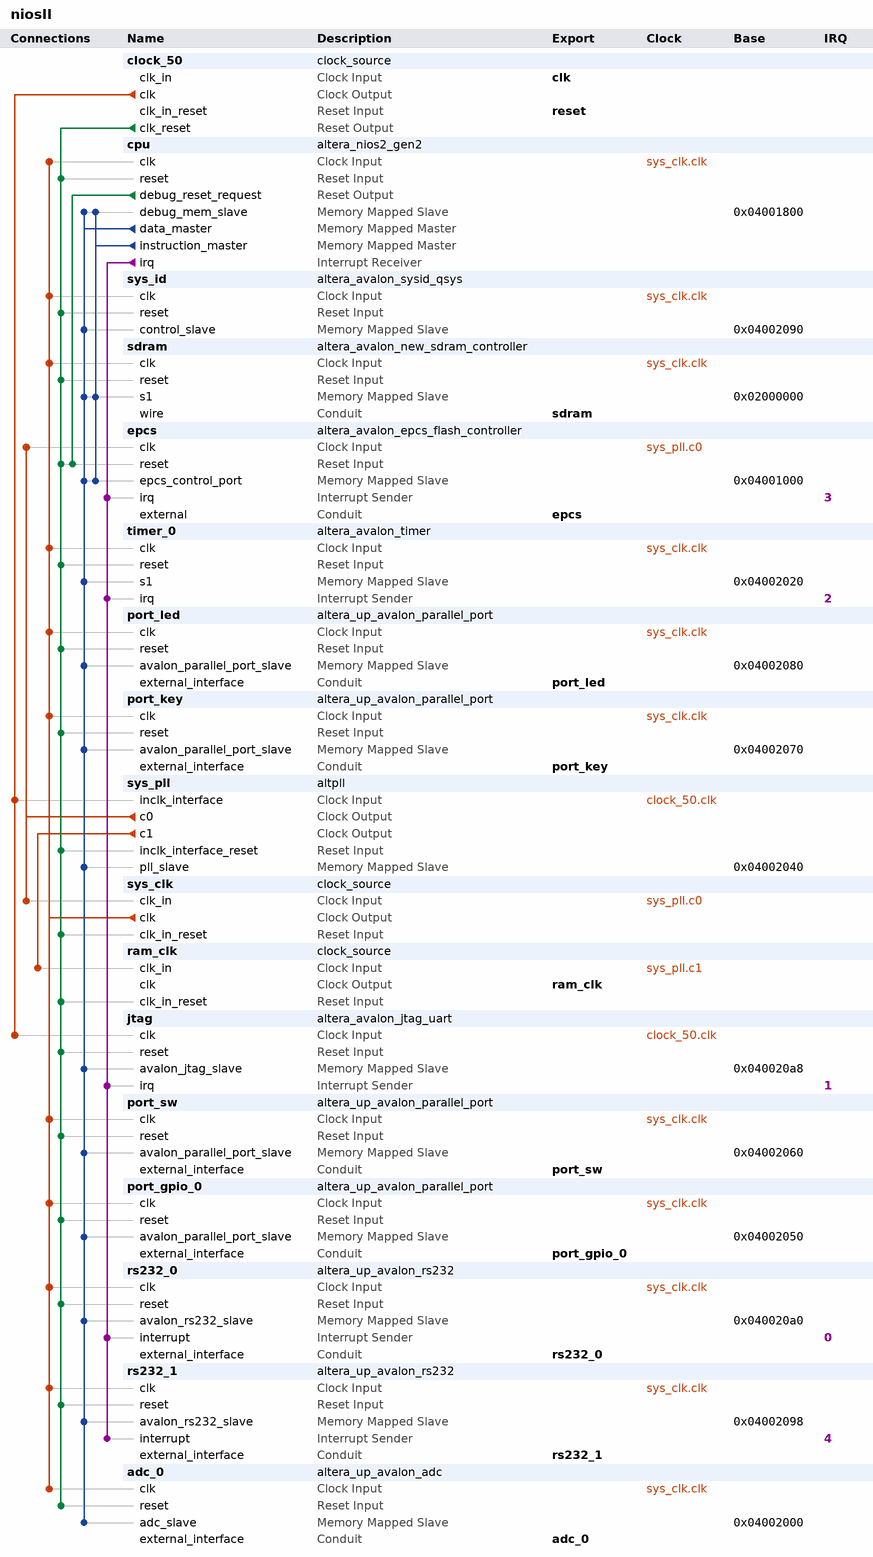
[diagram p0: system contents]
# Platform Designer (Qsys) system niosII, Cyclone IV E EP4CE22F17C6
# Parameters at their usual value, and those the tool derives, are not listed.
package require -exact qsys 17.1
create_system niosII
set_project_property DEVICE_FAMILY {Cyclone IV E}
set_project_property DEVICE EP4CE22F17C6

add_instance clock_50 clock_source 17.1
set_instance_parameter_value clock_50 clockFrequency 50000000

add_instance cpu altera_nios2_gen2 17.1
set_instance_parameter_value cpu dcache_size 2048
set_instance_parameter_value cpu exceptionSlave sdram.s1
set_instance_parameter_value cpu icache_size 4096
set_instance_parameter_value cpu impl Tiny
set_instance_parameter_value cpu resetSlave epcs.epcs_control_port

add_instance sys_id altera_avalon_sysid_qsys 17.1
set_instance_parameter_value sys_id id 0

add_instance sdram altera_avalon_new_sdram_controller 17.1
set_instance_parameter_value sdram TAC 5.5
set_instance_parameter_value sdram TRCD 20.0
set_instance_parameter_value sdram TRP 20.0
set_instance_parameter_value sdram casLatency 3
set_instance_parameter_value sdram columnWidth 9
set_instance_parameter_value sdram dataWidth 16
set_instance_parameter_value sdram generateSimulationModel false
set_instance_parameter_value sdram model single_Micron_MT48LC4M32B2_7_chip
set_instance_parameter_value sdram numberOfBanks 4
set_instance_parameter_value sdram numberOfChipSelects 1
set_instance_parameter_value sdram powerUpDelay 100.0
set_instance_parameter_value sdram refreshPeriod 15.625
set_instance_parameter_value sdram rowWidth 13

add_instance epcs altera_avalon_epcs_flash_controller 17.1
set_instance_parameter_value epcs resetrequest_enabled true

add_instance timer_0 altera_avalon_timer 17.1
set_instance_parameter_value timer_0 period 1
set_instance_parameter_value timer_0 periodUnits MSEC

add_instance port_led altera_up_avalon_parallel_port 17.1
set_instance_parameter_value port_led board DE0-Nano
set_instance_parameter_value port_led capture false
set_instance_parameter_value port_led edge Rising
set_instance_parameter_value port_led irq false
set_instance_parameter_value port_led preset LEDs

add_instance port_key altera_up_avalon_parallel_port 17.1
set_instance_parameter_value port_key board DE0-Nano
set_instance_parameter_value port_key capture false
set_instance_parameter_value port_key edge Rising
set_instance_parameter_value port_key irq false
set_instance_parameter_value port_key preset Pushbuttons

add_instance sys_pll altpll 17.1
set_instance_parameter_value sys_pll CLK0_DIVIDE_BY 1
set_instance_parameter_value sys_pll CLK0_MULTIPLY_BY 2
set_instance_parameter_value sys_pll CLK1_DIVIDE_BY 1
set_instance_parameter_value sys_pll CLK1_DUTY_CYCLE 50
set_instance_parameter_value sys_pll CLK1_MULTIPLY_BY 2
set_instance_parameter_value sys_pll CLK1_PHASE_SHIFT -1667
set_instance_parameter_value sys_pll INCLK0_INPUT_FREQUENCY 20000
set_instance_parameter_value sys_pll PORT_ARESET PORT_UNUSED
set_instance_parameter_value sys_pll PORT_LOCKED PORT_UNUSED
set_instance_parameter_value sys_pll PORT_clk1 PORT_USED
set_instance_parameter_value sys_pll PORT_clk2 PORT_UNUSED
set_instance_parameter_value sys_pll PORT_clk3 PORT_UNUSED

add_instance sys_clk clock_source 17.1
set_instance_parameter_value sys_clk clockFrequency 100000000

add_instance ram_clk clock_source 17.1
set_instance_parameter_value ram_clk clockFrequency 100000000

add_instance jtag altera_avalon_jtag_uart 17.1
set_instance_parameter_value jtag simInteractiveOptions NO_INTERACTIVE_WINDOWS

add_instance port_sw altera_up_avalon_parallel_port 17.1
set_instance_parameter_value port_sw board DE0-Nano
set_instance_parameter_value port_sw capture false
set_instance_parameter_value port_sw edge Rising
set_instance_parameter_value port_sw irq false
set_instance_parameter_value port_sw preset {Dip Switches}

add_instance port_gpio_0 altera_up_avalon_parallel_port 17.1
set_instance_parameter_value port_gpio_0 board DE0-Nano
set_instance_parameter_value port_gpio_0 capture false
set_instance_parameter_value port_gpio_0 edge Rising
set_instance_parameter_value port_gpio_0 irq false
set_instance_parameter_value port_gpio_0 preset {Expansion Header}

add_instance rs232_0 altera_up_avalon_rs232 17.1
set_instance_parameter_value rs232_0 baud 115200
set_instance_parameter_value rs232_0 parity None

add_instance rs232_1 altera_up_avalon_rs232 17.1
set_instance_parameter_value rs232_1 baud 115200
set_instance_parameter_value rs232_1 parity None

add_instance adc_0 altera_up_avalon_adc 17.1
set_instance_parameter_value adc_0 board DE0-Nano
set_instance_parameter_value adc_0 numch_ 8
set_instance_parameter_value adc_0 sclk_freq 3.2

# connections
add_connection clock_50.clk jtag.clk clock
add_connection clock_50.clk sys_pll.inclk_interface clock
add_connection sys_clk.clk adc_0.clk clock
add_connection sys_clk.clk cpu.clk clock
add_connection sys_clk.clk port_gpio_0.clk clock
add_connection sys_clk.clk port_key.clk clock
add_connection sys_clk.clk port_led.clk clock
add_connection sys_clk.clk port_sw.clk clock
add_connection sys_clk.clk rs232_0.clk clock
add_connection sys_clk.clk rs232_1.clk clock
add_connection sys_clk.clk sdram.clk clock
add_connection sys_clk.clk sys_id.clk clock
add_connection sys_clk.clk timer_0.clk clock
add_connection sys_pll.c0 epcs.clk clock
add_connection sys_pll.c0 sys_clk.clk_in clock
add_connection sys_pll.c1 ram_clk.clk_in clock
add_connection clock_50.clk_reset adc_0.reset reset
add_connection clock_50.clk_reset cpu.reset reset
add_connection clock_50.clk_reset epcs.reset reset
add_connection clock_50.clk_reset jtag.reset reset
add_connection clock_50.clk_reset port_gpio_0.reset reset
add_connection clock_50.clk_reset port_key.reset reset
add_connection clock_50.clk_reset port_led.reset reset
add_connection clock_50.clk_reset port_sw.reset reset
add_connection clock_50.clk_reset ram_clk.clk_in_reset reset
add_connection clock_50.clk_reset rs232_0.reset reset
add_connection clock_50.clk_reset rs232_1.reset reset
add_connection clock_50.clk_reset sdram.reset reset
add_connection clock_50.clk_reset sys_clk.clk_in_reset reset
add_connection clock_50.clk_reset sys_id.reset reset
add_connection clock_50.clk_reset sys_pll.inclk_interface_reset reset
add_connection clock_50.clk_reset timer_0.reset reset
add_connection cpu.debug_reset_request epcs.reset reset
add_connection cpu.data_master adc_0.adc_slave avalon
set_connection_parameter_value cpu.data_master/adc_0.adc_slave baseAddress 0x04002000
add_connection cpu.data_master cpu.debug_mem_slave avalon
set_connection_parameter_value cpu.data_master/cpu.debug_mem_slave baseAddress 0x04001800
add_connection cpu.data_master epcs.epcs_control_port avalon
set_connection_parameter_value cpu.data_master/epcs.epcs_control_port baseAddress 0x04001000
add_connection cpu.data_master jtag.avalon_jtag_slave avalon
set_connection_parameter_value cpu.data_master/jtag.avalon_jtag_slave baseAddress 0x040020a8
add_connection cpu.data_master port_gpio_0.avalon_parallel_port_slave avalon
set_connection_parameter_value cpu.data_master/port_gpio_0.avalon_parallel_port_slave baseAddress 0x04002050
add_connection cpu.data_master port_key.avalon_parallel_port_slave avalon
set_connection_parameter_value cpu.data_master/port_key.avalon_parallel_port_slave baseAddress 0x04002070
add_connection cpu.data_master port_led.avalon_parallel_port_slave avalon
set_connection_parameter_value cpu.data_master/port_led.avalon_parallel_port_slave baseAddress 0x04002080
add_connection cpu.data_master port_sw.avalon_parallel_port_slave avalon
set_connection_parameter_value cpu.data_master/port_sw.avalon_parallel_port_slave baseAddress 0x04002060
add_connection cpu.data_master rs232_0.avalon_rs232_slave avalon
set_connection_parameter_value cpu.data_master/rs232_0.avalon_rs232_slave baseAddress 0x040020a0
add_connection cpu.data_master rs232_1.avalon_rs232_slave avalon
set_connection_parameter_value cpu.data_master/rs232_1.avalon_rs232_slave baseAddress 0x04002098
add_connection cpu.data_master sdram.s1 avalon
set_connection_parameter_value cpu.data_master/sdram.s1 baseAddress 0x02000000
add_connection cpu.data_master sys_id.control_slave avalon
set_connection_parameter_value cpu.data_master/sys_id.control_slave baseAddress 0x04002090
add_connection cpu.data_master sys_pll.pll_slave avalon
set_connection_parameter_value cpu.data_master/sys_pll.pll_slave baseAddress 0x04002040
add_connection cpu.data_master timer_0.s1 avalon
set_connection_parameter_value cpu.data_master/timer_0.s1 baseAddress 0x04002020
add_connection cpu.instruction_master cpu.debug_mem_slave avalon
set_connection_parameter_value cpu.instruction_master/cpu.debug_mem_slave baseAddress 0x04001800
add_connection cpu.instruction_master epcs.epcs_control_port avalon
set_connection_parameter_value cpu.instruction_master/epcs.epcs_control_port baseAddress 0x04001000
add_connection cpu.instruction_master sdram.s1 avalon
set_connection_parameter_value cpu.instruction_master/sdram.s1 baseAddress 0x02000000
add_connection cpu.irq epcs.irq interrupt
set_connection_parameter_value cpu.irq/epcs.irq irqNumber 3
add_connection cpu.irq jtag.irq interrupt
set_connection_parameter_value cpu.irq/jtag.irq irqNumber 1
add_connection cpu.irq rs232_0.interrupt interrupt
set_connection_parameter_value cpu.irq/rs232_0.interrupt irqNumber 0
add_connection cpu.irq rs232_1.interrupt interrupt
set_connection_parameter_value cpu.irq/rs232_1.interrupt irqNumber 4
add_connection cpu.irq timer_0.irq interrupt
set_connection_parameter_value cpu.irq/timer_0.irq irqNumber 2

# exported interfaces
add_interface adc_0 conduit end
set_interface_property adc_0 EXPORT_OF adc_0.external_interface
add_interface clk clock sink
set_interface_property clk EXPORT_OF clock_50.clk_in
add_interface epcs conduit end
set_interface_property epcs EXPORT_OF epcs.external
add_interface port_gpio_0 conduit end
set_interface_property port_gpio_0 EXPORT_OF port_gpio_0.external_interface
add_interface port_key conduit end
set_interface_property port_key EXPORT_OF port_key.external_interface
add_interface port_led conduit end
set_interface_property port_led EXPORT_OF port_led.external_interface
add_interface port_sw conduit end
set_interface_property port_sw EXPORT_OF port_sw.external_interface
add_interface ram_clk clock source
set_interface_property ram_clk EXPORT_OF ram_clk.clk
add_interface reset reset sink
set_interface_property reset EXPORT_OF clock_50.clk_in_reset
add_interface rs232_0 conduit end
set_interface_property rs232_0 EXPORT_OF rs232_0.external_interface
add_interface rs232_1 conduit end
set_interface_property rs232_1 EXPORT_OF rs232_1.external_interface
add_interface sdram conduit end
set_interface_property sdram EXPORT_OF sdram.wire

set_interconnect_requirement {$system} qsys_mm.clockCrossingAdapter HANDSHAKE
set_interconnect_requirement {$system} qsys_mm.enableEccProtection FALSE
set_interconnect_requirement {$system} qsys_mm.insertDefaultSlave FALSE
set_interconnect_requirement {$system} qsys_mm.maxAdditionalLatency 1

save_system niosII.qsys
